# EAGLE board MAIN BOARD (EAGLE 5.11)
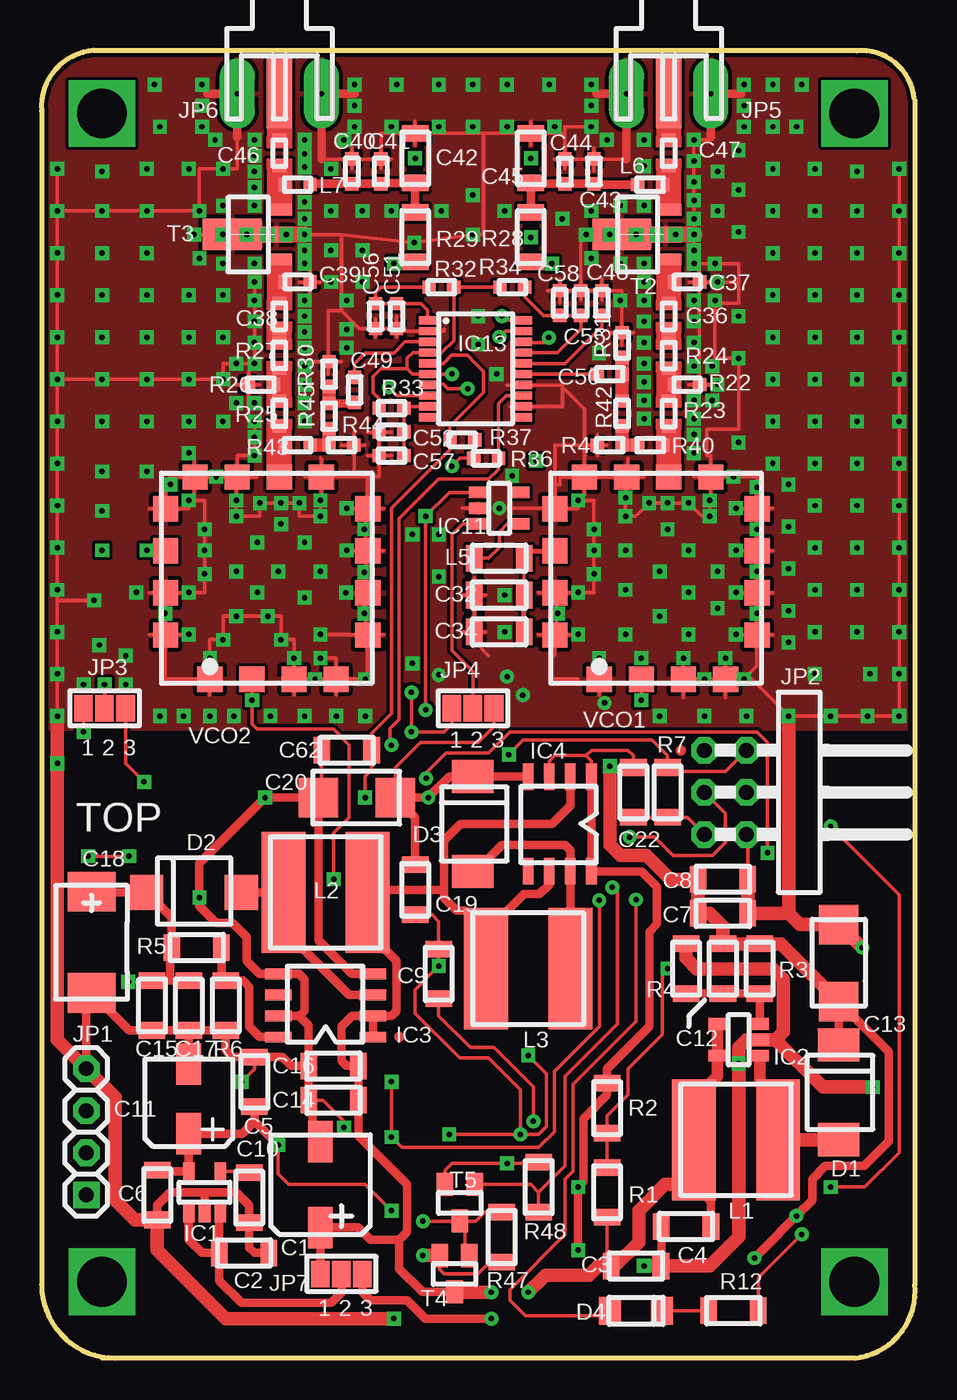
[diagram p2: board, top side]
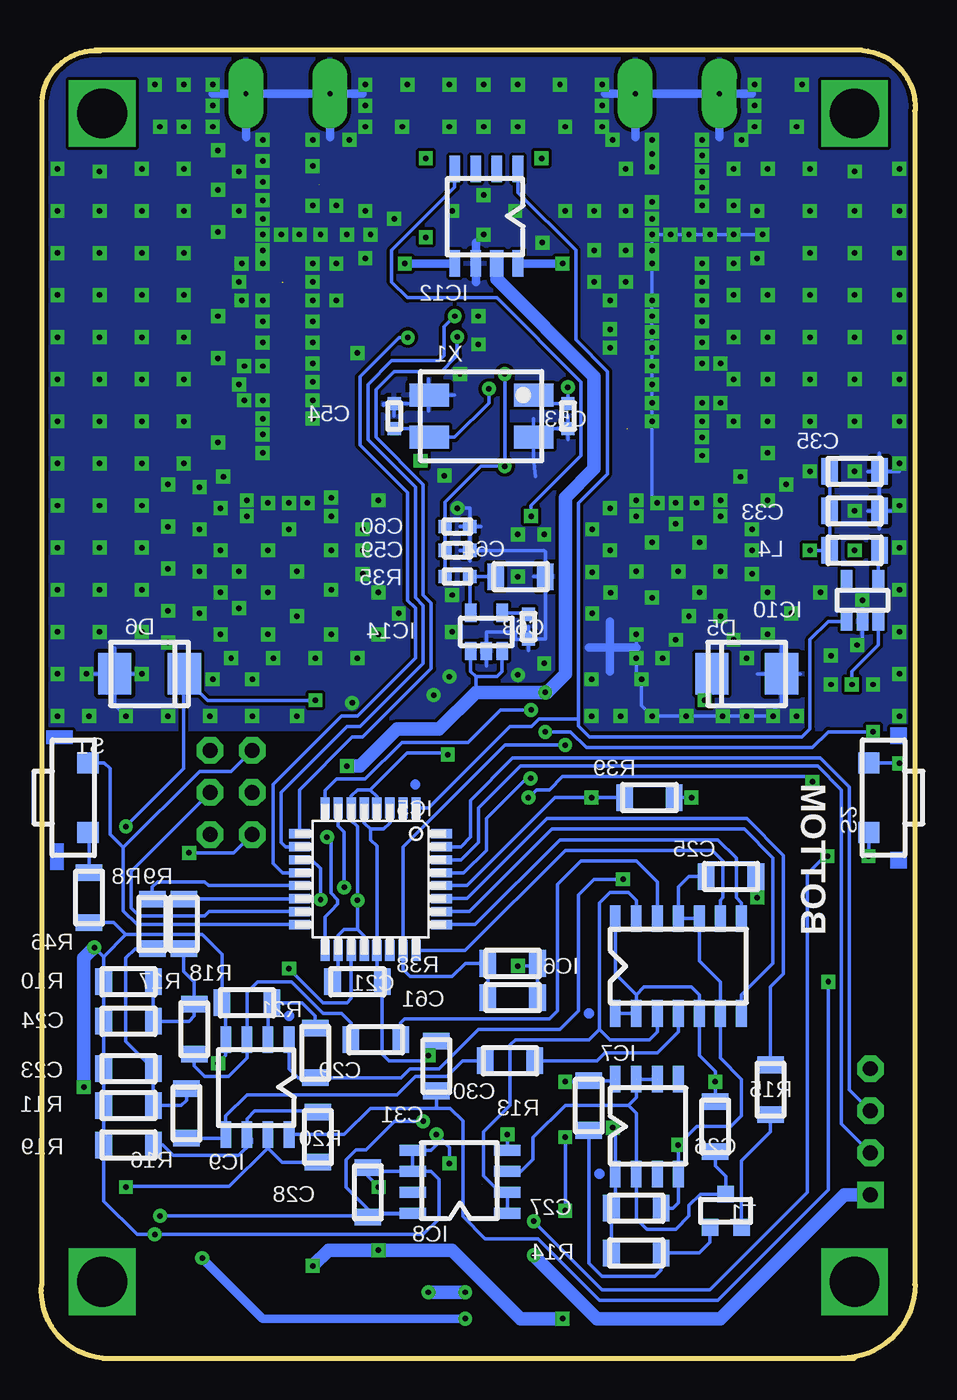
[diagram p3: board, bottom side, seen from below]

Size 52.73 x 78.9 mm. Coordinates in mm from the lower left corner, seen from the top.
Outline: 0.03,75.25 0.03,4.43
Outline: 3.18,78.9 49.54,78.9
Outline: 52.71,75.88 52.71,4.45 arc-90 49.06,0 4.45,0
Outline: 4.45,0 3.66,0
Outline: 3.18,78.9 arc90 0.01,75.25 arc-90 3.18,78.9
Outline: 52.67,76.01 arc90 49.18,78.86
Outline: 0.01,4.45 arc90 4.45,0
Copper layers (1*16): Top 0.035mm / dielectric 1.5mm / Bottom 0.035mm
Design rules "SparkFun *": minimum track width 7mil, minimum drill 13mil, track to track 8mil, track to pad 8mil, pad to pad 8mil, via to via 8mil, smd to smd 8mil, copper to edge 10mil, drill to drill 8mil, minimum pad ring 12mil, minimum via ring 10mil, stop-mask expansion 4mil, vias tented up to drill 25mil, thermal gap 10mil

## Footprints (pad centres in the part's own frame; a part is rotated, then mirrored left to right if it is on the bottom)
C1 = smd 1.5 x 2.5: 1 0,-2.594; 2 0,2.594
C2 = smd 1 x 1.6: 1 -1.5,0; 2 1.5,0
C3 = smd 1 x 1.6: 1 -1.5,0; 2 1.5,0
C4 = smd 1 x 1.6: 1 1.5,0; 2 -1.5,0
C5 = smd 1.6 x 1: 1 0,-1.5; 2 0,1.5
C6 = smd 1.6 x 1: 1 0,1.5; 2 0,-1.5
C7 = smd 1 x 1.6: 1 -1.5,0; 2 1.5,0
C8 = smd 1 x 1.6: 1 -1.5,0; 2 1.5,0
C9 = smd 1.6 x 1: 1 0,-1.5; 2 0,1.5
C10 = smd 1.6 x 1: 1 0,1.5; 2 0,-1.5
C11 = smd 1.5 x 2.5: 1 0,-1.865; 2 0,2.341
C12 = smd 1.6 x 1: 1 0,1.5; 2 0,-1.5
C13 = smd 2.388 x 2.388: 1 0,-2.311; 2 0,2.337
C14 = smd 1 x 1.6: 1 1.5,0; 2 -1.5,0
C15 = smd 1.6 x 1: 1 0,1.5; 2 0,-1.5
C16 = smd 1 x 1.6: 1 1.5,0; 2 -1.5,0
C17 = smd 1.6 x 1: 1 0,1.5; 2 0,-1.5
C18 = smd 2.896 x 2.388: 1 0,3.048; 2 0,-3.048
C19 = smd 1.6 x 1: 1 0,1.5; 2 0,-1.5
C20 = smd 2.388 x 2.388: 1 2.311,0; 2 -2.337,0
C21 = smd 1 x 1.6 bottom: 1 1.5,0; 2 -1.5,0
C22 = smd 1.6 x 1: 1 0,-1.5; 2 0,1.5
C23 = smd 1 x 1.6 bottom: 1 1.5,0; 2 -1.5,0
C24 = smd 1 x 1.6 bottom: 1 -1.5,0; 2 1.5,0
C25 = smd 1 x 1.6 bottom: 1 1.5,0; 2 -1.5,0
C26 = smd 1.6 x 1 bottom: 1 0,-1.5; 2 0,1.5
C27 = smd 1 x 1.6 bottom: 1 -1.5,0; 2 1.5,0
C28 = smd 1.6 x 1 bottom: 1 0,-1.5; 2 0,1.5
C29 = smd 1 x 1.6 bottom: 1 -1.5,0; 2 1.5,0
C30 = smd 1 x 1.6 bottom: 1 -1.5,0; 2 1.5,0
C31 = smd 1.6 x 1 bottom: 1 0,-1.5; 2 0,1.5
C32 = smd 1 x 1.6: 1 1.5,0; 2 -1.5,0
C33 = smd 1 x 1.6 bottom: 1 1.5,0; 2 -1.5,0
C34 = smd 1 x 1.6: 1 1.5,0; 2 -1.5,0
C35 = smd 1 x 1.6 bottom: 1 1.5,0; 2 -1.5,0
C36 = smd 0.8 x 0.8: 1 0,-0.75; 2 0,0.75
C37 = smd 0.8 x 0.8: 1 -0.75,0; 2 0.75,0
C38 = smd 0.8 x 0.8: 1 0,-0.75; 2 0,0.75
C39 = smd 0.8 x 0.8: 1 -0.75,0; 2 0.75,0
C40 = smd 0.8 x 0.8: 1 0,0.75; 2 0,-0.75
C41 = smd 0.8 x 0.8: 1 0,0.75; 2 0,-0.75
C42 = smd 1.6 x 1: 1 0,1.5; 2 0,-1.5
C43 = smd 0.8 x 0.8: 1 0,-0.75; 2 0,0.75
C44 = smd 0.8 x 0.8: 1 0,-0.75; 2 0,0.75
C45 = smd 1.6 x 1: 1 0,-1.5; 2 0,1.5
C46 = smd 0.8 x 0.8: 1 0,-0.75; 2 0,0.75
C47 = smd 0.8 x 0.8: 1 0,-0.75; 2 0,0.75
C48 = smd 0.8 x 0.8: 1 0,0.75; 2 0,-0.75
C49 = smd 0.8 x 0.8: 1 0,-0.75; 2 0,0.75
C50 = smd 0.8 x 0.8: 1 0.75,0; 2 -0.75,0
C51 = smd 0.8 x 0.8: 1 0,-0.75; 2 0,0.75
C52 = smd 0.8 x 0.8: 1 -0.75,0; 2 0.75,0
C53 = smd 0.8 x 0.8 bottom: 1 0,0.75; 2 0,-0.75
C54 = smd 0.8 x 0.8 bottom: 1 0,0.75; 2 0,-0.75
C55 = smd 0.8 x 0.8: 1 0,0.75; 2 0,-0.75
C56 = smd 0.8 x 0.8: 1 0,-0.75; 2 0,0.75
C57 = smd 0.8 x 0.8: 1 -0.75,0; 2 0.75,0
C58 = smd 0.8 x 0.8: 1 0,0.75; 2 0,-0.75
C59 = smd 0.8 x 0.8 bottom: 1 -0.75,0; 2 0.75,0
C60 = smd 0.8 x 0.8 bottom: 1 -0.75,0; 2 0.75,0
C61 = smd 1 x 1.6 bottom: 1 1.5,0; 2 -1.5,0
C62 = smd 1 x 1.6: 1 1.5,0; 2 -1.5,0
C63 = smd 0.8 x 0.8 bottom: 1 0,-0.75; 2 0,0.75
C64 = smd 1 x 1.6 bottom: 1 1.5,0; 2 -1.5,0
D1 = smd 2.5 x 2: 1 0,-2.856; 2 0,2.859
D2 = smd 2 x 2.1: 1 2.856,0; 2 -2.859,0
D3 = smd 2.5 x 2: 1 0,-2.856; 2 0,2.859
D4 = smd 1.315 x 1.68: 1 -1.568,0; 2 1.568,0
D5 = smd 2 x 2.5 bottom: 1 -2.1,0; 2 2.1,0
D6 = smd 2 x 2.5 bottom: 1 2.1,0; 2 -2.1,0
IC1 = smd 0.7 x 1.1: 1 -0.953,-1.27; 2 -0.001,-1.27; 3 0.951,-1.27; 4 0.952,1.27; 5 -0.954,1.27
IC2 = smd 1.1 x 0.7: 1 1.27,-0.953; 2 1.27,-0.001; 3 1.27,0.951; 4 -1.27,0.952; 5 -1.27,-0.954
IC3 = smd 1.6 x 0.65: 1 0,0; 2 0,1.27; 3 0,2.54; 4 0,3.81; 5 -5.715,3.81; 6 -5.715,2.54; 7 -5.715,1.27; 8 -5.715,0
IC4 = smd 0.65 x 1.6: 1 0,0; 2 -1.27,0; 3 -2.54,0; 4 -3.81,0; 5 -3.81,-5.715; 6 -2.54,-5.715; 7 -1.27,-5.715; 8 0,-5.715
IC5 = smd 0.559 x 1.27 bottom: 1 -2.743,4.293; 2 -1.956,4.293; 3 -1.168,4.293; 4 -0.381,4.293; 5 0.381,4.293; 6 1.168,4.293; 7 1.956,4.293; 8 2.743,4.293; 17 2.743,-4.293; 18 1.956,-4.293; 19 1.168,-4.293; 20 0.381,-4.293; 21 -0.381,-4.293; 22 -1.168,-4.293; 23 -1.956,-4.293; 24 -2.743,-4.293 | smd 1.27 x 0.559 bottom: 9 4.293,2.743; 10 4.293,1.956; 11 4.293,1.168; 12 4.293,0.381; 13 4.293,-0.381; 14 4.293,-1.168; 15 4.293,-1.956; 16 4.293,-2.743; 25 -4.293,-2.743; 26 -4.293,-1.956; 27 -4.293,-1.168; 28 -4.293,-0.381; 29 -4.293,0.381; 30 -4.293,1.168; 31 -4.293,1.956; 32 -4.293,2.743
IC6 = smd 0.65 x 1.6 bottom: 1 0,0; 2 -1.27,0; 3 -2.54,0; 4 -3.81,0; 5 -5.08,0; 6 -6.35,0; 7 -7.62,0; 8 -7.62,5.715; 9 -6.35,5.715; 10 -5.08,5.715; 11 -3.81,5.715; 12 -2.54,5.715; 13 -1.27,5.715; 14 0,5.715
IC7 = smd 0.65 x 1.6 bottom: 1 0,0; 2 -1.27,0; 3 -2.54,0; 4 -3.81,0; 5 -3.81,5.715; 6 -2.54,5.715; 7 -1.27,5.715; 8 0,5.715
IC8 = smd 1.6 x 0.65 bottom: 1 0,0; 2 0,1.27; 3 0,2.54; 4 0,3.81; 5 5.715,3.81; 6 5.715,2.54; 7 5.715,1.27; 8 5.715,0
IC9 = smd 0.65 x 1.6 bottom: 1 0,0; 2 1.27,0; 3 2.54,0; 4 3.81,0; 5 3.81,-5.715; 6 2.54,-5.715; 7 1.27,-5.715; 8 0,-5.715
IC10 = smd 0.7 x 1.1 bottom: 1 0.953,-1.27; 2 0.001,-1.27; 3 -0.951,-1.27; 4 -0.952,1.27; 5 0.954,1.27
IC11 = smd 1.1 x 0.7: 1 -1.27,0.953; 2 -1.27,0.001; 3 -1.27,-0.951; 4 1.27,-0.952; 5 1.27,0.954
IC12 = smd 0.65 x 1.6 bottom: 1 0,0; 2 1.27,0; 3 2.54,0; 4 3.81,0; 5 3.81,-5.715; 6 2.54,-5.715; 8 0,-5.715 | smd 0.8 x 1.6 bottom: 7 1.27,-5.715
IC13 = smd 1 x 0.5: 1 -2.9,2.925; 2 -2.9,2.275; 3 -2.9,1.625; 4 -2.9,0.975; 5 -2.9,0.325; 6 -2.9,-0.325; 7 -2.9,-0.975; 8 -2.9,-1.625; 9 -2.9,-2.275; 10 -2.9,-2.925; 11 2.9,-2.925; 12 2.9,-2.275; 13 2.9,-1.625; 14 2.9,-0.975; 15 2.9,-0.325; 16 2.9,0.325; 17 2.9,0.975; 18 2.9,1.625; 19 2.9,2.275; 20 2.9,2.925
IC14 = smd 0.7 x 1.1 bottom: 1 0.95,-1.15; 2 0.001,-1.15; 3 -0.95,-1.15; 4 -0.95,1.15; 5 0.95,1.15
JP1 = drill 0.9 pad 1.6 square: 1 0,0 | drill 0.9 pad 1.6 octagon: 2 0,2.54; 3 0,5.08; 4 0,7.62
JP2 = drill 0.9 pad 1.6 octagon: 1 0,0; 2 2.54,0; 3 0,-2.54; 4 2.54,-2.54; 5 0,-5.08; 6 2.54,-5.08
JP3 = smd 1.12 x 1.6: 1 -1.27,0; 2 0,0; 3 1.27,0
JP4 = smd 1.12 x 1.6: 1 -1.27,0; 2 0,0; 3 1.27,0
JP5 = drill 0.3 pad 2.096 long: 1 -2.54,-2.286; 3 2.54,-2.286 | smd 1.524 x 4.191: 2 0,-2.286
JP6 = drill 0.3 pad 2.096 long: 1 -2.54,-2.286; 3 2.54,-2.286 | smd 1.524 x 4.191: 2 0,-2.286
JP7 = smd 1.12 x 1.6: 1 -1.27,0; 2 0,0; 3 1.27,0
L1 = smd 2.65 x 7.3: 1 0,0; 2 5.08,0
L2 = smd 2.65 x 7.3: 1 0,0; 2 -5.08,0
L3 = smd 2.65 x 7.3: 1 0,0; 2 5.08,0
L4 = smd 1 x 1.6 bottom: 1 1.5,0; 2 -1.5,0
L5 = smd 1 x 1.6: 1 1.5,0; 2 -1.5,0
L6 = smd 0.8 x 0.8: 1 0.75,0; 2 -0.75,0
L7 = smd 0.8 x 0.8: 1 -0.75,0; 2 0.75,0
R1 = smd 1.6 x 1: 1 0,-1.5; 2 0,1.5
R2 = smd 1.6 x 1: 1 0,-1.5; 2 0,1.5
R3 = smd 1.6 x 1: 1 0,1.5; 2 0,-1.5
R4 = smd 1.6 x 1: 1 0,-1.5; 2 0,1.5
R5 = smd 1 x 1.6: 1 -1.5,0; 2 1.5,0
R6 = smd 1.6 x 1: 1 0,1.5; 2 0,-1.5
R7 = smd 1.6 x 1: 1 0,1.5; 2 0,-1.5
R8 = smd 1.6 x 1 bottom: 1 0,1.5; 2 0,-1.5
R9 = smd 1.6 x 1 bottom: 1 0,1.5; 2 0,-1.5
R10 = smd 1 x 1.6 bottom: 1 -1.5,0; 2 1.5,0
R11 = smd 1 x 1.6 bottom: 1 1.5,0; 2 -1.5,0
R12 = smd 1 x 1.6: 1 1.5,0; 2 -1.5,0
R13 = smd 1.6 x 1 bottom: 1 0,1.5; 2 0,-1.5
R14 = smd 1 x 1.6 bottom: 1 -1.5,0; 2 1.5,0
R15 = smd 1.6 x 1 bottom: 1 0,1.5; 2 0,-1.5
R16 = smd 1.6 x 1 bottom: 1 0,-1.5; 2 0,1.5
R17 = smd 1.6 x 1 bottom: 1 0,-1.5; 2 0,1.5
R18 = smd 1 x 1.6 bottom: 1 -1.5,0; 2 1.5,0
R19 = smd 1 x 1.6 bottom: 1 -1.5,0; 2 1.5,0
R20 = smd 1.6 x 1 bottom: 1 0,-1.5; 2 0,1.5
R21 = smd 1.6 x 1 bottom: 1 0,-1.5; 2 0,1.5
R22 = smd 0.8 x 0.8: 1 -0.75,0; 2 0.75,0
R23 = smd 0.8 x 0.8: 1 0,-0.75; 2 0,0.75
R24 = smd 0.8 x 0.8: 1 0,-0.75; 2 0,0.75
R25 = smd 0.8 x 0.8: 1 0,0.75; 2 0,-0.75
R26 = smd 0.8 x 0.8: 1 0.75,0; 2 -0.75,0
R27 = smd 0.8 x 0.8: 1 0,0.75; 2 0,-0.75
R28 = smd 1.6 x 1: 1 0,1.5; 2 0,-1.5
R29 = smd 1.6 x 1: 1 0,1.5; 2 0,-1.5
R30 = smd 0.8 x 0.8: 1 0,-0.75; 2 0,0.75
R31 = smd 0.8 x 0.8: 1 0,-0.75; 2 0,0.75
R32 = smd 0.8 x 0.8: 1 0.75,0; 2 -0.75,0
R33 = smd 0.8 x 0.8: 1 -0.75,0; 2 0.75,0
R34 = smd 0.8 x 0.8: 1 -0.75,0; 2 0.75,0
R35 = smd 0.8 x 0.8 bottom: 1 0.75,0; 2 -0.75,0
R36 = smd 0.8 x 0.8: 1 -0.75,0; 2 0.75,0
R37 = smd 0.8 x 0.8: 1 0.75,0; 2 -0.75,0
R38 = smd 1 x 1.6 bottom: 1 1.5,0; 2 -1.5,0
R39 = smd 1 x 1.6 bottom: 1 1.5,0; 2 -1.5,0
R40 = smd 0.8 x 0.8: 1 -0.75,0; 2 0.75,0
R41 = smd 0.8 x 0.8: 1 0.75,0; 2 -0.75,0
R42 = smd 0.8 x 0.8: 1 0,0.75; 2 0,-0.75
R43 = smd 0.8 x 0.8: 1 0.75,0; 2 -0.75,0
R44 = smd 0.8 x 0.8: 1 -0.75,0; 2 0.75,0
R45 = smd 0.8 x 0.8: 1 0,0.75; 2 0,-0.75
R46 = smd 1.6 x 1 bottom: 1 0,1.5; 2 0,-1.5
R47 = smd 1.6 x 1: 1 0,1.5; 2 0,-1.5
R48 = smd 1.6 x 1: 1 0,-1.5; 2 0,1.5
S1 = smd 1.27 x 1.27 bottom: 1 -0.885,2.1; 2 -0.885,-2.1
S2 = smd 1.27 x 1.27 bottom: 1 0.885,-2.1; 2 0.885,2.1
T1 = smd 1 x 1 bottom: 1 0.95,-1; 2 -0.95,-1; 3 0,1
T2 = smd 1.524 x 0.711: 1 2.2,-1.5; 3 2.2,1.5 | smd 1.85 x 0.965: 2 2.037,0 | smd 3.556 x 1.905: 4 -0.635,0
T3 = smd 1.524 x 0.711: 1 2.2,-1.5; 3 2.2,1.5 | smd 1.85 x 0.965: 2 2.037,0 | smd 3.556 x 1.905: 4 -0.635,0
T4 = smd 1 x 1.4: 1 0.9,1.111; 2 -0.9,1.111; 3 0,-1.089
T5 = smd 1 x 1.4: 1 0.9,1.111; 2 -0.9,1.111; 3 0,-1.089
VCO1 = smd 1.524 x 1.524: 1 0,0; 2 2.54,0; 3 5.08,0; 4 7.62,0; 5 9.525,2.667; 6 9.525,5.207; 7 9.525,7.747; 8 9.525,10.287; 9 6.731,12.192; 10 4.191,12.192; 11 1.651,12.192; 12 -0.889,12.192; 13 -2.667,10.287; 14 -2.667,7.747; 15 -2.667,5.207; 16 -2.667,2.667
VCO2 = smd 1.524 x 1.524: 1 0,0; 2 2.54,0; 3 5.08,0; 4 7.62,0; 5 9.525,2.667; 6 9.525,5.207; 7 9.525,7.747; 8 9.525,10.287; 9 6.731,12.192; 10 4.191,12.192; 11 1.651,12.192; 12 -0.889,12.192; 13 -2.667,10.287; 14 -2.667,7.747; 15 -2.667,5.207; 16 -2.667,2.667
X1 = smd 2.4 x 1.4 bottom: 1 0,0; 2 0,-2.54; 3 6.3,-2.54; 4 6.3,0

## Placement (x,y rotation side)
C1  100u/6.3V  [C1]  16.83,10.48 0 top
C2  100n  [C2]  12.23,6.35 0 top
C3  100n  [C3]  35.88,5.56 0 top
C4  1u  [C4]  38.9,7.94 0 top
C5  1u  [C5]  12.86,16.67 0 top
C6  100n  [C6]  6.99,9.84 0 top
C7  100n  [C7]  41.12,26.83 0 top
C8  1u  [C8]  41.12,28.89 0 top
C9  100n  [C9]  23.98,23.18 0 top
C10  10n  [C10]  12.55,9.68 0 top
C11  100u/4V  [C11]  8.89,15.4 0 top
C12  470p  [C12]  41.12,23.5 0 top
C13  100u/10V  [C13]  48.11,23.81 0 top
C14  1u  [C14]  17.63,15.56 0 top
C15  1u  [C15]  6.67,21.27 0 top
C16  100n  [C16]  17.63,17.62 0 top
C17  100n  [C17]  8.89,21.27 0 top
C18  22u/35V  [C18]  3.02,25.08 0 top
C19  100n  [C19]  22.55,28.26 0 top
C20  68u/16V  [C20]  19.05,33.81 0 top
C21  100n  [C21]  33.66,22.7 0 top
C22  100n  [C22]  35.72,34.13 0 top
C23  4.7u  [C23]  47.47,17.46 0 top
C24  4.7u  [C24]  47.47,20.32 0 top
C25  100n  [C25]  11.12,29.05 0 top
C26  100n  [C26]  12.07,13.97 0 top
C27  100n  [C27]  16.83,9.05 0 top
C28  100n  [C28]  33.02,10 0 top
C29  4.7u  [C29]  32.55,19.21 0 top
C30  4.7u  [C30]  24.45,17.94 0 top
C31  100n  [C31]  28.9,17.62 0 top
C32  100n  [C32]  27.63,46.04 0 top
C33  100n  [C33]  3.66,51.12 0 top
C34  1u  [C34]  27.63,43.81 0 top
C35  1u  [C35]  3.66,53.5 0 top
C36  68p  [C36]  37.85,62.87 0 top
C37  *  [C37]  38.96,64.93 0 top
C38  100p  [C38]  14.36,62.87 0 top
C39  *  [C39]  15.46,64.93 0 top
C40  68p  [C40]  18.74,71.6 0 top
C41  1000p  [C41]  20.48,71.6 0 top
C42  1u  [C42]  22.55,72.39 0 top
C43  22p  [C43]  33.34,71.6 0 top
C44  1000p  [C44]  31.6,71.6 0 top
C45  1u  [C45]  29.53,72.39 0 top
C46  100p  [C46]  14.36,72.71 0 top
C47  68p  [C47]  37.85,72.71 0 top
C48  100p  [C48]  33.82,63.66 0 top
C49  100p  [C49]  18.9,58.42 0 top
C50  100p  [C50]  34.29,59.37 0 top
C51  100p  [C51]  21.44,62.87 0 top
C52  100p  [C52]  21.12,55.88 0 top
C53  22p  [C53]  20.96,56.83 0 top
C54  22p  [C54]  31.44,56.83 0 top
C55  100p  [C55]  32.55,63.66 0 top
C56  10n  [C56]  20.17,62.87 0 top
C57  10n  [C57]  21.12,54.45 0 top
C58  10n  [C58]  31.28,63.66 0 top
C59  100n  [C59]  27.63,48.74 0 top
C60  1u  [C60]  27.63,50.16 0 top
C61  100n  [C61]  24.29,21.75 0 top
C62  100n  [C62]  18.42,36.67 0 top
C63  10n  [C63]  23.34,44.13 0 top
C64  1u  [C64]  23.82,47.15 0 top
D1  SS14  [D1]  48.11,16.03 0 top
D2  SS14  [D2]  9.21,28.1 0 top
D3  SS14  [D3]  26.04,32.23 0 top
D4  GREEN  [D4]  35.88,2.86 0 top
D5  SMAZ22-13-F  [D5]  10.16,41.27 0 top
D6  SMAZ22-13-F  [D6]  46.2,41.27 0 top
IC1  TPS79333  [IC1]  9.85,10 0 top
IC2  LM2731Y  [IC2]  42.07,19.21 0 top
IC3  LT1173CS8  [IC3]  20.01,19.37 0 top
IC4  LT1301CS8  [IC4]  33.18,35.08 0 top
IC5  ATMEGA168-10V  [IC5]  32.87,28.89 0 top
IC6  AD8402ARZ10  [IC6]  18.1,20.8 0 top
IC7  NE555D  [IC7]  18.1,11.11 0 top
IC8  LM358D  [IC8]  24.61,8.73 0 top
IC9  LM358D  [IC9]  37.79,19.21 0 top
IC10  MIC2514  [IC10]  3.18,45.72 0 top
IC11  MIC2514  [IC11]  27.63,51.28 0 top
IC12  MIC2506YM  [IC12]  23.98,71.75 0 top
IC13  LMX2433  [IC13]  26.2,59.69 0 top
IC14  LP2985AIM5-2.5CT  [IC14]  25.88,43.81 0 top
JP1  USB/Batt Board  [JP1]  2.7,9.84 0 top
JP2  ISP  [JP2]  40.01,36.67 0 top
JP3  VCO voltage select  [JP3]  3.81,39.21 0 top
JP4  VCO Voltage select  [JP4]  26.04,39.21 0 top
JP5  SMA J629-ND  [JP5]  37.85,78.58 0 top
JP6  SMA J629-ND  [JP6]  14.36,78.58 0 top
JP7  3.3V supply select  [JP7]  18.1,5.08 0 top
L1  7.3uH  [L1]  39.37,13.18 0 top
L2  33uH  [L2]  19.69,28.1 0 top
L3  33uH  [L3]  26.83,23.5 0 top
L4  FERRIT  [L4]  3.66,48.74 0 top
L5  FERRIT  [L5]  27.63,48.26 0 top
L6  22nH  [L6]  36.73,70.8 0 top
L7  33nH  [L7]  15.46,70.8 0 top
R1  510K  [R1]  34.14,10 0 top
R2  330K  [R2]  34.14,15.08 0 top
R3  47K  [R3]  43.34,23.5 0 top
R4  13K  [R4]  38.9,23.5 0 top
R5  820K  [R5]  9.37,24.77 0 top
R6  50K  [R6]  11.12,21.27 0 top
R7  10K  [R7]  37.79,34.13 0 top
R8  1K  [R8]  46.04,26.19 0 top
R9  1K  [R9]  44.14,26.19 0 top
R10  *  [R10]  47.47,22.7 0 top
R11  *  [R11]  47.47,15.24 0 top
R12  750  [R12]  41.76,2.86 0 top
R13  10K  [R13]  19.69,15.24 0 top
R14  20K  [R14]  16.83,6.35 0 top
R15  68  [R15]  8.74,16.19 0 top
R16  10K  [R16]  43.98,14.76 0 top
R17  10K  [R17]  43.5,19.84 0 top
R18  10K  [R18]  40.33,21.43 0 top
R19  10K  [R19]  47.47,12.86 0 top
R20  30K(47K)  [R20]  36.04,13.34 0 top
R21  30K(47K)  [R21]  36.2,18.41 0 top
R22  *  [R22]  38.96,58.74 0 top
R23  0  [R23]  37.85,56.99 0 top
R24  0  [R24]  37.85,60.48 0 top
R25  0  [R25]  14.36,56.99 0 top
R26  *  [R26]  13.24,58.74 0 top
R27  0  [R27]  14.36,60.48 0 top
R28  1  [R28]  29.53,67.63 0 top
R29  1  [R29]  22.55,67.63 0 top
R30  50  [R30]  17.35,59.37 0 top
R31  50  [R31]  35.04,61.12 0 top
R32  18  [R32]  24.13,64.61 0 top
R33  18  [R33]  21.12,57.31 0 top
R34  18  [R34]  28.42,64.61 0 top
R35  18  [R35]  27.63,47.15 0 top
R36  10K  [R36]  26.83,54.29 0 top
R37  10K  [R37]  25.4,55.4 0 top
R38  10K  [R38]  24.29,23.81 0 top
R39  10K  [R39]  16.04,33.81 0 top
R40  10  [R40]  36.73,55.09 0 top
R41  120  [R41]  34.29,55.09 0 top
R42  10  [R42]  35.04,56.99 0 top
R43  22  [R43]  15.46,55.09 0 top
R44  47  [R44]  18.1,55.09 0 top
R45  22  [R45]  17.35,56.83 0 top
R46  100  [R46]  49.85,27.78 0 top
R47  100K  [R47]  27.79,7.3 0 top
R48  100K  [R48]  30.01,10.32 0 top
S1  Cycle Program  [S1]  50.8,33.81 0 top
S2  Power ON  [S2]  1.91,33.81 0 top
T1  MMBT3906  [T1]  11.43,8.89 0 top
T2  GALI-84 / SGA-7489Z  [T2]  35.65,67.79 0 top
T3  GALI-84 / SGA-7489Z  [T3]  12.16,67.79 0 top
T4  FDN302P  [T4]  24.93,5.08 0 top
T5  FDV303N  [T5]  25.25,9.37 0 top
VCO1  ROS-2700-1819  [VCO1]  33.66,40.96 0 top
VCO2  ROS-1300  [VCO2]  10.16,40.96 0 top
X1  10MHz  [X1]  23.02,58.1 0 top

## Tracks (layer width: path | path; a pad name or v marks a point on that pad's centre or on a via)
1  (via drill 0.33 pad 0.25)
  Top 0.2: T4.2 24.03,5.34 24.29,5.08 26.36,5.08 26.83,5.56 27.54,5.56 R47.2
  Top 0.8: v23.02,6.19 T4.2
  Bottom 0.8: JP1.1 4.29,9.84 11.75,2.38 19.21,2.38 v23.02,6.19
2
  Top 0.5: L1.2 44.45,15.56 | D1.1
  Top 0.7: IC2.1 43.34,16.67 44.45,15.56
  Top 0.8: L1.2 D1.1
3
  Bottom 0.2: JP1.3 3.97,16.19 3.97,34.45 5.72,36.2 24.29,36.2 26.83,33.66 26.83,31.43 27.42,30.85 IC5.31
3.3V  (via drill 0.33)  (1 unrouted)
  Top 0.2: v21.12,16.67 v21.12,13.34 21.75,12.7 30.01,12.7 30.96,13.65 30.96,17.3 33.66,20 v33.66,27.61 | v21.12,8.89 19.53,10.48 14.93,10.48 IC7.4 v14.29,12.86 | JP2.2 41.28,35.4 38.02,35.4 R7.1 37.79,36.35 36.83,37.31 29.05,37.31 v28.21,36.41
  Top 0.5: C6.1 7.06,11.27 IC1.5 C11.1 12.11,13.53 12.86,14.29 | 12.86,14.29 C5.1 | 12.86,14.29 v14.29,12.86
  Bottom 0.2: IC5.4 32.49,33.88 32.9,34.29 | 32.9,34.29 33.66,34.29 34.03,33.91 IC5.6 34.03,32.44 33.66,32.07 v33.66,27.61 33.66,25.88 | IC5.20 33.25,25.46 33.66,25.88 | 33.66,25.88 34.45,25.88 34.82,25.51 IC5.18 34.82,23.04 C21.1 | IC7.8 18.19,16.74 R13.1 19.76,16.67 v21.12,16.67 | v21.12,8.89 v21.12,13.34 | C25.1 13.66,29.05 14.29,28.42 IC6.11 IC6.10 13.02,23.97 11.75,22.7 IC6.6 11.75,18.1 10.48,16.83 10.48,14.61 11.12,13.97 13.18,13.97 v14.29,12.86 IC7.4 14.29,9.37 14.61,9.05 C27.1 | 32.9,34.29 30.68,36.51 28.31,36.51 v28.21,36.41
  Bottom 0.5: IC5.20
5V  (via drill 0.33, 0.33 pad 0.25)
  Top 0.2: v29.69,14.29 29.69,16.35 27.31,18.73 25.88,18.73 23.98,20.64 C9.1 | JP4.1 24.77,38.26 24.29,37.78 v22.33,37.78 v22.33,40.16 | v2.54,37.78 JP3.1
  Top 0.5: v27.15,2.38 23.18,2.38 22.07,3.49 19.85,3.49 19.37,3.97 JP7.3 | D1.2 C13.1 51.12,18.48 51.12,13.07 49.64,11.59 47.31,11.59 46.52,10.79 46.52,9.53 v45.57,8.57 43.52,6.53 v43.03,6.03
  Top 0.8: v34.29,35.72 34.29,30.96 34.93,30.32 36.52,30.32 37.95,28.89 C8.1 C7.1 40.33,26.83 41.12,26.04 C12.1 R3.1 44.61,25 C13.1
  Bottom 0.2: IC14.3 24.93,41.43 25.25,41.12 26.52,41.12 | 26.52,41.12 26.83,41.43 IC14.1 | 26.52,40.16 26.52,41.12 | v22.33,37.78 20.8,37.78 19.85,36.83 6.2,36.83 5.24,37.78 v2.54,37.78 | 45.49,8.5 v45.57,8.57 33.73,8.57 33.6,8.7 30.36,8.7 IC8.8 32.78,8.73 33.02,8.97 | v29.69,14.29 31.42,14.29 33.15,12.55 33.75,12.55 34.35,11.95 34.35,10.3 33.02,8.97 | 33.02,8.97 C28.1
  Bottom 0.5: v27.15,2.38 39.38,2.38 v43.03,6.03
  Bottom 0.8: v34.29,35.72 33.5,35.72 31.28,37.94 28.74,37.94 26.52,40.16 v22.33,40.16 22.23,40.16 21.12,41.27 21.12,51.91 19.37,53.66 19.37,59.21 25.25,65.09 IC12.7
12V  (via drill 0.33)
  Top 0.2: C20.1 21.37,35.65 22.86,37.15 26.36,37.15 27.31,38.1 JP4.3 | v6.2,34.77 5.08,35.88 JP3.3
  Top 0.5: IC4.4 D3.2 24.61,35.09 v23.34,33.81 C20.1 22.55,32.63 C19.1
  Bottom 0.2: v23.34,33.81 22.86,34.29 22.07,34.29 21.28,35.08 6.51,35.08 v6.2,34.77
24V  (via drill 0.33)
  Top 0.2: v5.24,22.7 6.6,22.7 C15.1
  Top 0.5: C15.1 7.78,22.77 | C18.1 3.05,28.1 D2.2 7.87,26.58 R5.1 7.78,24.68 7.78,22.77 | 7.78,22.77 C17.1
  Bottom 0.2: 28.9,15.08 C31.1 | 28.9,15.08 32.87,15.08 34.45,13.49 IC9.8 | v5.24,22.7 5.24,10.16 11.91,3.49 19.05,3.49 22.76,7.2 25.95,7.2 27.3,8.55 27.3,14.3 28.08,15.08 28.9,15.08
+
  Bottom 0.2: C30.2 27.31,17.94 28.26,16.99 30.17,16.99 31.28,15.88 40.33,15.88 41.6,14.61 IC9.5 41.83,13.26 R16.1
BYPASS
  Top 0.2: IC1.4 12.46,11.27 C10.1
CLK
  Bottom 0.2: IC6.9 11.75,27.62 11.59,27.78 11.59,30 12.23,30.64 21.12,30.64 27.16,24.6 IC5.24
CPOUTRF  (via drill 0.33)
  Top 0.2: IC13.13 28.07,58.06 27.58,57.58 R36.2 27.58,53.61 26.99,53.02 23.98,53.02 21.59,50.64 21.59,38.54 21.05,38 21.05,37.05 v21.12,36.99
  Bottom 0.2: C61.1 R38.1 27.15,23.81 27.94,23.02 30.48,23.02 30.91,23.44 IC5.23 30.91,25 30.91,30.85 24.77,36.99 v21.12,36.99
CS  (1 unrouted)
  Bottom 0.2: IC6.7 10.48,21.91 8.58,23.81 8.58,30.16 10.32,31.91 21.91,31.91 26.88,26.94 IC5.26
CTLA
  Bottom 0.2: IC5.1 29.37,33.19 24.45,38.1 23.15,38.1 22.7,38.55 20.32,38.55 | IC10.1 5.24,44.45 6.35,43.34 6.35,37.94 6.83,37.47 19.67,37.47 20.32,38.12 20.32,38.55 | IC12.1 23.98,70.33 20.48,66.83 20.48,61.44 18.58,59.53 18.58,53.34 20.32,51.59 20.32,38.55
  Bottom 0.406: IC10.1
CTLB  (via drill 0.33)
  Top 0.2: v23.18,39.11 v23.18,50.8 24.61,52.23 IC11.1
  Bottom 0.2: IC5.8 35.61,34.25 34.93,34.92 33.18,34.92 30.96,37.15 26.99,37.15 25.03,39.11 v23.18,39.11 | IC12.4 27.79,70.64 31.6,66.83 31.6,64.93 30.64,63.98 25.25,63.98 20.17,58.9 20.17,54.45 23.18,51.44 v23.18,50.8
DATA  (via drill 0.33)
  Top 0.2: v27.79,62.87 28.04,62.62 IC13.20
  Bottom 0.2: IC5.10 38,30.85 38.26,31.11 38.26,34.13 34.29,38.1 33.5,38.1 29.69,41.91 29.69,45.4 30.17,45.88 30.17,52.55 33.02,55.4 33.02,58.74 31.6,60.17 28.74,60.17 28.42,60.48 28.42,62.23 v27.79,62.87
  Bottom 0.5: IC5.10
FB
  Top 0.5: R4.1 C12.2 R3.2 IC2.3
FINRF#
  Top 0.2: IC13.16 31.6,60.02 33.82,62.23 C48.2
G  (via drill 0.33, 0.33 pad 0.25)
  Top 0.2: 25.9,6.12 T4.1 25.56,6.46 25.56,7.96 T5.3 25.22,8.26 | v5.29,30.28 v2.81,30.28 | v23.02,8.26 25.05,8.26 25.22,8.26 | 25.22,8.26 26.2,8.26 26.75,8.8 R47.1
  Top 0.406: T5.3 25.05,8.28 25.05,8.26
  Bottom 0.2: S2.1 2.86,31.65 2.81,31.6 v2.81,30.28 | v23.02,8.26 18.9,4.13 12.39,4.13 6.51,10 6.51,29.21 5.44,30.28 v5.29,30.28
GND  (via drill 0.33, 0.33 pad 0.25)  (1 unrouted)
  Top 0.2: C19.2 23.57,26.76 23.98,26.35 C9.2 v23.98,23.65 22.55,22.23 22.55,20.8 25.25,18.1 26.99,18.1 28.9,16.19 v28.9,13.49 | IC4.1 33.18,36.04 32.87,36.35 | 32.87,36.35 30.96,36.35 30.64,36.04 IC4.3 | C62.2 16.92,34.02 C20.2 | v12.07,16.67 12.86,17.46 C5.2 | v28.9,13.49 v24.61,13.49 | 10.48,53.15 10.48,53.18 | v8.89,51.75 9.85,51.75 v9.85,50.01 v9.85,48.74 v9.85,47.31 9.85,46.2 v8.89,46.2 7.5,46.2 | 7.5,46.2 VCO2.15 7.47,46.2 | 7.47,43.62 VCO2.16 7.47,43.66 | 7.47,43.66 v7.47,44.93 7.47,46.2 | 7.47,43.66 v8.89,43.66 | 7.47,43.62 7.47,40.96 VCO2.1 | VCO2.1 v10.16,42.23 10.16,43.34 v10.96,43.34 10.96,44.77 v11.75,44.77 v13.66,44.77 14.45,44.77 v14.45,43.34 15.24,43.34 v15.24,42.23 VCO2.3 | VCO2.3 v16.51,40.96 VCO2.4 | 19.69,53.18 VCO2.8 | 19.69,48.74 v18.42,48.74 | VCO2.8 18.42,51.24 | 16.9,53.18 16.9,51.75 v16.83,51.75 v16.83,50.8 15.56,50.8 v15.56,51.59 v14.45,51.59 v13.18,51.59 13.18,50.8 v11.75,50.8 v11.75,51.75 11.75,53.02 | 19.69,43.66 v16.83,43.66 | VCO2.4 17.78,42.23 v16.83,42.23 | VCO2.5 20.01,43.66 | 33.98,53.15 VCO1.12 | VCO1.12 31.28,53.15 31.28,52.7 30.99,52.7 | 33.98,53.15 33.98,53.18 | 30.99,46.2 v32.39,46.2 33.34,46.2 v33.34,47.31 v33.34,48.74 v33.34,50.01 33.34,51.75 v32.39,51.75 32.39,51.24 VCO1.13 | 30.99,46.2 VCO1.15 30.96,46.2 | 30.96,43.62 VCO1.16 30.96,43.66 | 30.96,43.66 v31.16,44.93 30.96,46.2 | 30.96,43.66 v32.39,43.66 | 30.96,43.62 30.96,42.39 | 30.96,40.96 32.39,40.96 | v33.66,42.23 VCO1.1 33.66,40.01 | VCO1.3 v38.74,42.23 | VCO1.4 v40.01,40.96 VCO1.3 | VCO1.6 41.91,46.16 | 43.18,48.74 v41.91,48.74 | VCO1.8 41.91,51.24 v41.91,51.28 | 40.39,53.18 40.39,51.75 v40.33,51.75 v40.33,50.8 39.85,50.8 v39.06,51.59 v37.79,51.59 v36.68,51.59 35.88,50.8 v35.25,50.8 v35.25,51.91 35.31,51.91 VCO1.11
  Top 0.2: 43.18,43.66 v41.91,43.66 | VCO1.4 v41.28,42.23 | VCO1.5 43.5,43.66 | 7.47,43.66 7.47,43.62 | 19.69,43.66 v19.49,44.93 v19.49,47.42 19.69,48.74 | 19.69,48.74 v19.49,50.01 VCO2.8 | 30.96,43.66 30.96,43.62 | VCO1.6 v43.18,44.93 43.18,43.66 | VCO1.8 v43.18,50.01 43.18,48.74 | 40.39,53.18 v41.76,53.18 43.18,53.18 v43.18,52.55 43.18,51.28 | IC11.2 | 30.96,51.28 30.48,51.75 | 26.99,42.39 26.13,43.25 C34.2 | C34.2 C32.2 | v0.96,38.73 v0.96,41.27 v0.96,43.81 0.96,45.72 | VCO2.11 11.91,53.24 | C32.2 26.83,46.04 | C32.2 25.4,46.04 | C32.2 26.13,47.08 | C34.2 26.83,43.81 | C34.2 25.4,43.81 | v8.89,51.75 8.89,51.24 VCO2.13 | VCO2.13 7.5,52.7 v7.78,52.7 7.78,53.15 9.21,53.15 | VCO2.8 20.64,51.24 | 19.69,48.74 20.64,48.74 | 19.69,43.66 VCO2.5 | 19.69,43.66 20.01,43.66 | VCO2.4 17.78,40.01 | VCO2.3 15.24,40.01 | VCO2.1 10.16,40.01 | 7.47,43.66 6.51,43.66 | 7.5,46.2 7.47,46.2 | VCO2.13 6.51,51.24 | 10.48,53.15 9.21,53.15 | 9.21,53.15 9.21,52.07 v8.89,51.75 | 9.21,53.15 9.21,54.13 | 30.99,52.7 VCO1.13 | VCO1.12 32.77,52.07 32.71,52.07 | 40.39,53.18 40.39,54.45 40.17,54.45 40.17,56.04 42.07,56.04 v42.07,60.33 40.64,60.33 40.64,63.66 42.07,63.66 42.07,64.93 | 43.18,51.28 44.14,51.28 | VCO1.8 43.18,51.28 | 43.18,48.74 44.14,48.74 | 43.18,46.2 44.14,46.2 | VCO1.6 43.18,46.2 | 43.5,43.66 43.18,43.66 | VCO1.5 43.18,43.66 | VCO1.4 41.28,39.85 | VCO1.3 38.74,39.85 | 30.99,46.2 30.96,46.2 | 30.96,43.66 30.01,43.66 | 0.96,45.72 v3.18,45.72 | IC11.2 25.4,51.28 | 43.18,48.74 v43.18,47.47 43.18,46.2 | 20.01,43.66 20.64,43.66 | 7.47,46.2 6.51,46.2 | 43.5,43.66 44.14,43.66 | 30.96,46.2 30.01,46.2 | v51.76,71.75 v51.76,69.22 v51.76,66.67 v51.76,64.14 v51.76,61.59 v51.76,59.05 v51.76,56.52 v51.76,53.98 v51.76,51.44 v51.76,48.9 v51.76,46.35 v51.76,43.81 v51.76,41.27 v51.76,38.73 v49.85,38.73 v47.63,38.73 v45.09,38.73 42.87,40.96 v42.39,40.96
  Top 0.2: 0.96,45.72 v0.96,46.35 v0.96,48.9 v0.96,51.44 v0.96,53.98 v0.96,56.52 v0.96,59.05 | v0.96,59.05 v0.96,61.59 v0.96,64.14 v0.96,66.67 v0.96,69.22 | v0.96,69.22 v0.96,71.75 | v12.86,64.93 v12.86,63.82 v12.86,62.55 v12.86,61.28 v12.86,60.01 v11.75,60.01 10.96,60.01 v10.96,59.05 v8.89,59.05 v6.35,59.05 v3.66,59.05 v0.96,59.05 | 35.41,53.15 35.41,54.29 | VCO1.11 35.41,53.15 | VCO1.11 33.98,53.15 | C14.2 16.99,15.56 18.25,14.3 v18.25,13.9 | v45.88,7.46 43.26,4.83 R12.1 | 30.96,51.28 v27.63,51.28 IC11.2 | 42.07,64.93 v40.8,64.93 C37.2 | C37.2 39.71,65.56 39.69,65.56 39.69,64.93 | C37.2 39.69,64.93 | 39.69,64.93 39.06,64.93 | 40.39,53.18 39.37,53.18 | 35.41,53.15 36.36,53.15 | 35.31,72.35 C43.2 | C43.2 C44.2 | C44.2 31.6,73.89 | 31.6,73.89 C45.2 | C42.1 20.48,73.89 C41.1 | C41.1 C40.1 | C40.1 16.9,72.35 | C43.2 33.34,73.03 | C43.2 33.34,71.6 | C44.2 30.96,72.35 | C44.2 31.6,71.75 | C45.2 29.53,74.61 | C45.2 29.53,73.18 | C42.1 22.55,74.61 | C42.1 22.55,73.18 | C41.1 21.12,72.35 | C41.1 20.48,71.75 | C40.1 18.74,73.03 | C40.1 18.74,71.75 | 40.39,73.66 40.39,73.5 v39.37,73.5 v39.37,72.23 v39.37,70.96 v39.37,69.85 v39.37,68.74 v39.37,67.79 v39.37,66.83 v39.37,66.04 v40.64,66.04 42.07,66.04 42.07,64.93 | 31.6,73.89 31.6,74.3 v33.18,74.3 | v38.26,67.79 v37.15,67.79 v35.88,67.79 v34.29,67.79 v32.87,67.79 32.55,67.47 C55.1 | C45.2 26.67,73.89 | 26.67,73.89 C42.1 | 11.75,53.02 VCO2.11 | VCO2.11 11.82,54.45 v12.86,54.45 v12.86,55.56 v12.86,56.52 12.49,56.52 R26.2 | v9.21,67.79 v10.96,67.79 T3.4 v12.39,67.79 v13.66,67.79 T3.2 | v15.88,66.04 16.21,66.04 C39.2 | v15.88,63.82 16.21,63.82 | C39.2 16.83,64.93 | v0.96,69.22 v3.66,69.22 v6.35,69.22 v9.53,69.22 9.53,71.75 v10.96,71.75 11.82,71.75 11.82,73.66
  Top 0.2: 16.9,53.18 15.88,53.18 | 26.67,73.89 26.67,67.79 v26.04,67.79 v22.5,67.3 18.1,67.79 | 11.75,53.15 10.48,53.15 | VCO1.13 30.96,51.28 | C39.2 15.56,64.93 | 11.75,53.02 11.75,53.15 | 32.87,36.35 33.18,36.67 35.41,36.67 35.72,36.35 C22.2 | C8.2 42.62,31.52 JP2.6 | C55.1 C48.1 | C55.1 C58.1 | C57.1 C52.1 | C51.1 21.59,61.97 IC13.2 24.29,61.97 24.29,62.07 | C56.1 C51.1 | C56.1 19.17,62.12 18.1,63.18 | VCO1.12 32.77,57.24 31.44,58.58 | 18.1,67.79 v15.88,67.79 | C58.1 30.53,64.41 | C58.1 31.28,65.09 | C58.1 31.28,63.66 | C55.1 32.55,63.82 | C48.1 33.82,65.09 | C48.1 33.82,63.82 | 31.44,58.58 31.44,57.41 IC13.12 28.26,57.41 | 31.44,58.58 31.44,58.72 IC13.14 28.1,58.72 | C51.1 21.44,62.87 | C51.1 21.44,61.59 | C56.1 20.17,61.59 | C56.1 20.17,62.71 | VCO2.4 v19.53,40.96 19.69,41.12 VCO2.5 | 16.9,53.18 16.9,54.23 16.83,54.29 | R44.2 18.85,55.88 | R44.2 18.1,55.09 | R44.2 19.53,55.09 | 16.21,63.82 C39.2 | 16.21,63.82 16.21,63.77 | 18.1,67.79 18.1,63.18 | R26.2 12.49,59.53 12.55,59.53 | R26.2 13.18,58.74 | R26.2 11.75,58.74 | 20.37,53.23 C57.1 | 20.32,53.18 20.37,53.23 | 20.32,53.18 20.37,53.18 20.37,53.23 | 18.85,53.23 R44.2 | 16.9,53.18 18.85,53.18 | 18.9,53.18 18.85,53.23 | 18.85,53.18 18.9,53.18 | C52.1 19.69,55.88 | C52.1 20.37,56.58 | C52.1 21.12,55.88 | C57.1 19.69,54.45 | C57.1 21.12,54.45 | 18.1,63.18 17.31,63.18 17.31,60.12 | 17.31,60.12 15.88,60.12 v15.88,59.85 | 17.31,60.12 17.31,59.37 | 17.31,60.12 18.1,60.12 | VCO2.11 11.75,53.15 | 39.69,64.93 39.69,58.76 | 39.69,58.76 R22.2 | R22.2 39.71,58.12 | R22.2 40.33,58.74 | 39.69,58.76 39.67,58.74 | R22.2 39.67,58.74 | 39.67,58.74 39.06,58.74 | R41.2 30.99,55.09 30.99,52.7 | R41.2 34.14,55.09 | R41.2 33.54,54.45 | R41.2 33.54,55.72
  Top 0.2: C48.1 35.04,64.41 R31.2 | R31.2 35.04,61.12 | R31.2 35.72,61.87 | R31.2 34.29,61.87 34.29,61.75 | 19.69,53.18 20.32,53.18 | 18.85,53.18 18.85,53.23 | 18.9,53.18 19.69,53.18 | VCO2.11 12.99,53.15 | v42.39,40.96 VCO1.4 | 2.7,21.72 C18.2 | v29.37,18.26 30.48,17.14 30.48,13.97 30.01,13.49 v28.9,13.49 | T5.2 24.35,11.32 24.77,11.75 v28.1,11.75 29.94,11.75 R48.2 | v42.39,40.96 43.18,41.75 VCO1.5 | 13.18,23.18 IC3.5
  Top 0.5: IC4.1 IC4.8 36.2,29.37 37.15,28.42 37.15,26.19 36.68,25.72 36.68,20 34.14,17.46 R2.2 34.14,15.88 32.71,14.45 32.71,10.64 v32.39,10.32 v32.39,6.51 | C16.2 15.09,17.62 14.54,18.17 C5.2 11.52,18.17 11.12,18.57 R6.2 C17.2 | 37.4,5.57 C4.2 | C16.2 16.13,20.07 15.56,20.64 | 15.56,20.64 15.88,20.95 15.88,22.86 15.56,23.18 13.18,23.18 12.39,23.97 12.39,25.4 11.54,26.25 10.55,26.25 9.53,27.27 v9.53,27.78 9.53,29.84 v13.5,33.81 C20.2 16.72,25.2 18.74,23.18 IC3.4 | C18.2 5.28,19.77 C15.2 C17.2 | C16.2 C14.2 16.36,15.33 16.36,13.55 C1.2 | 15.56,20.64 IC3.7 | C17.2 C11.2 | C6.2 6.99,9.21 7.78,10 9.85,10 | C2.2 12.86,6.35 12.55,6.67 C10.2 12.55,9.21 11.75,10 9.85,10 | 9.85,10 IC1.2 | 35.31,72.35 JP5.1 33.5,76.3 | 16.9,72.35 JP6.3 18.9,76.3 | 42.23,76.3 JP5.3 40.39,73.66 | 11.82,73.66 JP6.1 10.01,76.3 | v49.53,24.77 49.49,24.77 | JP1.4 2.7,21.72 | T5.2
  Top 0.8: v21.28,2.38 11.12,2.38 6.99,6.51 C6.2 5.63,8.34 4.45,9.53 4.45,15.72 JP1.4 0.96,19.21 v0.96,35.88 v0.96,38.73 | 44.3,19.21 44.77,19.68 44.77,22.86 44.14,23.5 39.53,23.5 38.9,24.13 R4.2 | C8.2 C7.2 45.09,26.83 | 44.3,19.21 IC2.2 42.55,19.21 42.07,18.73 v42.07,17.78 42.07,7.3 40.34,5.57 37.4,5.57 C3.2 v36.36,5.56 | 49.49,24.77 C13.2 45.77,26.15 45.09,26.83 | v50.17,16.35 47.15,16.35 44.3,19.21 | 45.09,26.83 v45.09,38.73
  Top 0.965: v39.37,67.79 v38.26,67.79 | v15.88,67.79 v14.77,67.79
  Bottom 0.2: v13.5,33.81 R39.2 | IC8.6 29.21,11.27 28.74,10.79 28.74,8.41 29.69,7.46 v45.88,7.46 46.96,7.46 48.97,9.47 R19.2 R11.1 C23.1 C24.2 R10.2 48.97,24.22 | 47.63,25.56 48.97,24.22 | 47.63,25.56 43.03,25.56 41.83,24.36 R18.2 41.6,21.2 IC9.4 41.6,18.26 v42.07,17.78 | C31.2 29.14,19.12 29.37,18.89 | IC8.6 32.79,11.27 C28.2 33.02,10.95 v32.39,10.32 | IC8.6 IC8.5 29.21,12.54 28.9,12.86 v28.9,13.49 28.1,12.7 v28.1,11.75 | IC6.14 18.1,23.18 16.83,21.91 | IC6.1 IC6.2 16.83,21.91 | 16.83,21.91 16.36,22.38 13.5,22.38 13.02,21.91 IC6.5 13.02,18.26 12.07,17.3 v12.07,16.67 C26.2 | 32.87,31.91 32.87,31.27 32.49,30.89 IC5.21 32.49,23.03 C21.2 32.16,18.34 31.75,17.94 29.69,17.94 v29.37,18.26 | IC5.5 33.25,32.29 32.87,31.91 | 32.87,31.91 32.07,31.91 31.7,32.28 IC5.3 | v16.83,43.66 16.83,42.86 v16.83,42.23 16.83,41.27 v16.51,40.96 16.51,39.37 v15.88,38.73 v13.82,38.73 v11.61,38.73 v10.16,38.73 v8.58,38.73 8.58,39.05 8.06,39.56 D5.1 | C33.2 C35.2 | C35.2 0.96,53.5 v0.96,53.98 | C33.2 0.96,51.12 v0.96,51.44 | C35.2 2.16,54.61 | C35.2 2.86,53.5 | C33.2 2.86,51.12 | C33.2 2.16,50.01 | v3.18,45.72 3.18,43.5 | v9.53,27.78 9.53,28.96 C25.2 | C60.1 C59.1 | C59.1 22.39,48.74 22.32,48.66 C64.2 | C60.1 26.88,51.28 v27.63,51.28 | C60.1 26.2,50.16 | C60.1 27.47,50.16 | C59.1 27.47,48.74 | C59.1 26.88,48.1 | C64.2 23.02,47.15 | C64.2 22.32,43.38 C63.1 | C63.1 23.34,44.13 | C63.1 23.34,43.34 | 23.34,43.34 24.13,43.34 24.13,43.81 25.88,43.81 IC14.2 25.88,41.75 | 23.34,43.34 23.34,42.7 | v9.21,67.79 v10.96,67.79 v12.39,67.79 v13.66,67.79 v14.77,67.79 v15.88,67.79 v15.88,66.83 v15.88,66.04 v15.88,63.82 v15.88,62.87 v15.88,61.91 v15.88,60.96 v15.88,59.85 v15.88,58.74 v15.88,57.63 v15.88,56.52 15.88,51.91 v15.56,51.59
  Bottom 0.2: 48.97,24.22 49.52,24.77 v49.53,24.77 | 23.02,55.56 22.5,56.08 C53.2 | X1.4 29.84,57.58 C54.1 | 23.02,55.56 23.02,54.29 22.91,53.18 | v26.04,67.79 26.52,67.31 | C54.1 31.44,56.83 | C54.1 32.07,57.58 32.07,57.47 | 29.37,58.1 29.37,57.15 | X1.4 29.37,58.1 | X1.4 27.79,58.1 | 29.37,58.1 29.37,59.05 | 23.02,55.56 23.02,56.67 | C53.2 20.96,56.83 | 20.96,55.4 C53.2 | v23.98,23.65 22.95,23.65 R38.2 C61.2 | R46.2 48.35,26.28 47.63,25.56 | R14.2 C27.2 18.1,9.28 IC7.1 18.1,13.75 v18.25,13.9 | v24.61,13.49 IC8.4 | v47.63,38.73 48.3,39.41 D6.1 | D6.1 48.3,42.83 | D6.1 v50.01,41.27 | D6.1 v46.68,41.27 | D5.1 6.92,41.27 | D5.1 8.06,42.98 | D5.1 9.53,41.27 | v0.96,35.88 0.99,35.91 S2.2
  Bottom 0.5: 18.42,42.86 18.42,44.45 | 16.83,42.86 18.42,42.86 | 18.42,42.86 18.42,41.43 | 18.42,42.86 19.69,42.86 | JP5.3 42.39,76.3 | JP5.3 JP5.1 | JP5.1 35.31,73.66 | JP5.1 33.34,76.3 | JP5.3 40.39,73.66 | 26.52,67.31 IC12.6 26.52,64.93 | JP6.1 JP6.3 | JP6.3 18.74,76.3 | JP6.1 9.85,76.3 | JP6.1 11.82,73.66 | JP6.3 16.9,73.66 | v29.37,18.26 29.37,18.89
  Bottom 0.8: v49.53,24.77 50.17,24.13 v50.17,16.35 | v21.28,2.38 23.82,2.38 27.94,6.51 v32.39,6.51 35.41,6.51 v36.36,5.56
  other vias: 16.83,47.47 15.88,49.21 14.29,47.47 46.68,56.52 49.22,56.52 44.14,56.52 39.06,48.74 37.79,50.01 35.25,48.74 45.09,50.16 6.83,76.83 26.04,76.83 35.25,43.66 36.2,42.23 39.06,43.66 40.8,45.24 49.22,43.81 49.22,46.35 46.68,46.35 46.68,43.81 45.09,45.09 45.09,47.62 39.06,46.2 37.31,44.77 37.31,47.47 40.8,47.47 35.25,46.35 37.31,38.73 40.01,38.73 42.55,38.73 28.1,41.12 29.06,40.01 33.98,39.53 45.09,43.18 27.94,46.04 27.94,43.81 46.68,48.9 49.22,48.9 49.22,51.44 41.91,46.2 46.68,53.98 49.22,53.98 46.68,51.44 45.09,52.7 44.14,53.98 42.07,55.24 44.14,59.05 46.68,59.05 49.22,59.05 49.22,66.67 46.68,66.67 44.14,66.67 44.14,69.22 46.68,69.22 49.22,69.22 49.22,64.14 49.22,61.59 46.68,61.59 44.14,64.14 44.14,61.59 46.68,64.14 42.07,62.87 42.07,67.94 40.8,69.22 42.07,70.48 40.64,63.82 27.47,59.37 26.36,61.16 26.36,62.87 33.18,66.36 34.93,66.04 36.36,62.55 36.36,63.82 36.36,64.93 36.36,66.04 36.36,61.28 36.36,60.01 36.36,58.9 36.36,57.78 36.36,56.67 39.37,55.72 39.37,56.67 40.49,57.78 39.37,57.78 40.8,58.74 40.49,59.85 39.37,59.85 17.47,66.83 17.47,69.22 19.37,69.22 21.12,69.22 19.37,66.83 19.37,64.93 17.47,64.93 18.42,63.82 26.04,70.17 24.13,69.22 15.88,68.74 15.88,69.75 10.96,69.53 9.53,66.36 10.96,66.04 12.86,66.04 10.96,64.14 8.89,64.14 6.35,64.14 6.35,66.67 15.88,73.5 15.88,72.65 15.88,71.86 17.47,71.75 18.9,75.56 18.9,76.83 21.44,76.83 18.9,74.3 18.26,73.5 9.69,76.83 9.69,75.56 9.69,74.3 10.48,73.5 12.86,73.5 12.86,72.55 12.86,71.6 12.86,70.64 8.89,71.75 7.15,74.3 6.35,71.75 39.37,54.61 33.66,60.64 39.37,63.82 39.37,62.55 34.93,63.82 39.37,61.28 18.42,62.07 18.42,60.96 10.96,61.59 8.89,61.59 6.35,61.59 3.66,61.59 3.66,64.14 3.66,66.67 3.66,71.6 12.86,69.53 8.89,54.61 10.54,53.18 10.96,56.52 12.86,57.63 11.75,57.63 8.89,56.52 3.66,56.52 6.35,56.52 6.35,53.5 3.66,51.12 13.02,49.21 14.45,50.32 3.66,53.5 13.02,46.2 11.75,47.47 15.88,45.88 23.98,41.22 22.39,41.91 22.39,49.69 23.98,47.15 23.98,49.69 28.41,53.24 18.42,51.28 23.98,76.83 28.1,76.83 30.64,76.83 33.18,76.83 33.18,75.56 36.36,73.5 34.14,73.5 42.39,74.3 42.39,76.83 44.14,76.83 45.88,76.83 45.57,74.3 44.14,74.3 44.14,71.75 42.07,72.87 40.8,71.6 36.36,69.53 34.93,69.53 31.44,68.74 33.18,69.22 36.36,71.91 28.1,74.3 30.96,74.3 26.04,74.3 23.98,74.3 21.12,74.3 27.94,69.22 49.22,71.6 46.68,71.75 42.39,75.56 3.5,43.02 5.08,42.39 5.08,40.64 2.54,40.64 5.72,46.2 7.15,38.73 18.38,46.18 17.78,38.73 19.53,38.73
  pour Top: 0.05,79 53.05,79 53.05,38 0.05,38
  pour Bottom: 0.05,79 53.05,79 53.05,38 0.05,38
IN  (via drill 0.33)
  Top 0.2: JP3.2 v3.81,40.64
  Bottom 0.2: IC10.3 2.23,43.02 3.81,41.43 v3.81,40.64
  Bottom 0.406: IC10.3
LE  (via drill 0.33 pad 0.25)
  Top 0.2: IC13.18 29.14,61.28 30.32,61.28 v30.62,61.58
  Bottom 0.2: IC5.12 38.17,29.27 38.74,29.84 38.74,34.61 34.61,38.73 33.66,38.73 30.17,42.23 30.17,45.24 30.64,45.72 30.64,52.23 33.5,55.09 33.5,59.21 31.44,61.28 31.14,61.58 v30.62,61.58
  Bottom 0.5: IC5.12
LOWBATT  (via drill 0.33)
  Top 0.2: R1.2 R2.1 34.14,14.61 35.41,15.88 35.41,17.46 37.47,19.53 37.47,23.18 v37.79,23.5
  Bottom 0.2: IC5.19 34.03,21.69 34.29,21.43 35.72,21.43 v37.79,23.5
  Bottom 0.5: IC5.19
MISO
  Bottom 0.2: IC5.16 46.95,26.15 47.79,26.99 47.79,30.8 | 47.79,30.8 43.18,35.4 41.28,35.4 JP2.1 | 47.79,30.8 48.58,31.59 48.58,35.56 48.94,35.91 S1.1
  Bottom 0.5: IC5.16
MOSI
  Bottom 0.2: IC5.15 42.6,26.94 42.87,26.67 46.84,26.67 47.31,27.15 47.31,29.37 JP2.4
  Bottom 0.5: IC5.15
N$1  (via drill 3)
  other vias: 3.66,4.6
N$2  (via drill 3)
  other vias: 49.06,4.6
N$49  (via drill 0.33)
  other vias: 3.66,48.74
N$137  (via drill 0.33)
  other vias: 29.53,72.39
N$138  (via drill 0.33)
  other vias: 22.55,72.39
N$172  (via drill 3)
  other vias: 3.66,75.09
N$173  (via drill 3)
  other vias: 49.06,75.09
N$178  (via drill 0.33)
  other vias: 29.85,54.13
N$180  (via drill 0.33)
  other vias: 29.53,67.63
OSCIN  (via drill 0.33)
  Top 0.2: IC13.8 21.47,58.06 v20.96,58.58
  Bottom 0.2: X1.1 22.5,57.58 C53.1 v20.96,58.58
OUT
  Bottom 0.2: IC6.13 16.83,27.62 17.31,28.1 18.42,28.1 19.05,27.46 19.05,19.84 | 19.05,19.84 18.42,19.21 16.04,19.21 15.56,19.68 IC6.3 | 19.05,19.84 19.69,19.21 24.13,19.21 24.45,18.89 24.45,15.24 26.05,13.64 26.05,11 25.05,10 IC8.2 IC8.1
OUTA  (via drill 0.33)
  Top 0.2: 22.46,66.04 R29.2
  Top 0.5: v21.28,66.04 22.46,66.04
  Bottom 0.5: v21.28,66.04 IC12.8
OUTB  (via drill 0.33)
  Top 0.2: 29.62,66.04 R28.2
  Top 0.5: v30.8,66.04 29.62,66.04
  Bottom 0.5: IC12.5 v30.8,66.04
PCI12/ADC4/SDA/PC4
  Bottom 0.2: IC5.27 27.05,27.72 22.23,32.54 10.16,32.54 7.94,30.32 7.94,23.18 8.74,22.38 R15.1
PCI13/ADC5/SCL/PC5  (via drill 0.33)
  Top 0.2: v19.53,33.81 19.53,35.08 19.92,35.47 C62.1 19.92,37.7 21.12,38.89 21.12,51.28 24.65,54.81 R37.2 24.65,56.24 26.67,58.26 26.67,59.53 26.19,60.02 25.71,60.5 24.75,60.5 24.27,60.02 IC13.5
  Bottom 0.2: IC5.28 27.06,28.51 21.75,33.81 v19.53,33.81 R39.1
PCI23/AIN1/PD7  (via drill 0.33)
  Top 0.2: D4.1 34,2.54 29.21,2.54 28.26,3.49 28.26,4.13 31.6,7.46 31.6,10.79 32.07,11.27 32.07,16.51 35.88,20.32 v35.88,27.66
  Bottom 0.2: v35.88,27.66 35.88,29.53 36.42,30.06 37.05,30.06 IC5.11
  Bottom 0.5: IC5.11 37.05,30.06
PIN3
  Top 0.2: L6.1 37.85,70.8 | T2.3 C47.1 38.01,71.96 38.05,72 38.05,71.37 L6.1 | L6.1 37.47,70.8
RESET  (via drill 0.33)
  Top 0.2: C22.1 R7.2 38.97,32.63 JP2.5 | v43.82,30.48 43.82,37.15 43.18,37.78 28.26,37.78 26.98,36.5 24.4,36.5 23.21,35.31 v23.21,34.98
  Bottom 0.2: IC5.29 27.25,29.27 25.88,30.64 25.88,32.54 23.45,34.98 v23.21,34.98 | v43.82,30.48 41.12,30.48 JP2.5
SCK  (via drill 0.33)
  Top 0.2: v35.5,31.43 36.99,31.43 38.1,30.32 40.49,30.32 41.28,31.11 41.28,32.86 JP2.3
  Bottom 0.2: IC5.17 35.61,25 35.61,26.63 35.25,26.99 34.85,27.39 34.85,27.65 35.25,28.05 35.25,31.19 v35.5,31.43
  Bottom 0.5: IC5.17 35.61,25
SDI
  Bottom 0.2: IC5.25 26.56,26.15 21.44,31.27 11.91,31.27 10.8,30.16 10.8,27.78 10.48,27.46 IC6.8
SIG$8
  Top 0.5: R6.1 11.35,23 | IC3.8 13.18,19.37 12.55,20 12.55,22.38 12.16,22.77 R6.1 | R5.2 10.87,23.02 R6.1
SIG$18
  Bottom 0.2: IC5.13 42.65,28.51 42.87,28.73 45.72,28.73 46.04,28.42 R8.1
  Bottom 0.5: IC5.13
SIG$19
  Bottom 0.2: R9.1 37.19,27.69 IC5.14
  Bottom 0.5: IC5.14
SIG$20
  Top 0.2: D4.2 R12.2
SIG$22
  Bottom 0.2: IC5.30 27.41,30.06 26.36,31.11 26.36,33.18 23.82,35.72 5.88,35.72 4.45,34.29 4.45,14.13 JP1.2
  Bottom 0.5: IC5.30
SIG$30
  Bottom 0.2: R13.2 19.69,5.71 18.9,4.92 15.72,4.92 15.33,5.31 R14.1 13.02,6.35 12.38,6.99 T1.1
SIG$31
  Bottom 0.2: T1.2 10.48,11.9 8.74,13.65 R15.2
SIG$34
  Bottom 0.2: C30.1 19.21,17.94 18.74,18.41 15.56,18.41 14.29,19.68 IC6.4
SIG$35
  Bottom 0.2: IC6.12 15.56,28.73 16.83,30 20.17,30 21.59,28.57 21.59,20.95 22.07,20.48 30.8,20.48 31.05,20.23 C29.1
SIG$37
  Bottom 0.2: C29.2 34.05,20.23 34.61,20.8 35.72,20.8 37.63,22.7 39.69,22.7 40.33,22.07 IC9.3 40.33,18.1 41.44,16.99 42.87,16.99 43.5,17.62 R17.1
SIG$39
  Bottom 0.2: 36.13,14.92 39.85,14.92 40.33,14.45 IC9.6 40.05,13.22 40.05,13 40.83,12.22 44.77,12.22 45.41,12.86 R19.1
  Bottom 0.406: R20.2 36.13,14.84 36.13,14.92
SIG$40
  Bottom 0.2: IC9.2 39.06,21.2 R18.1 36.99,21.43 36.2,20.64 R21.2
SIG$41  (via drill 0.33)
  Top 0.2: VCO2.2 v12.7,39.69 12.7,38.26 13.02,37.94 17.63,37.94 18.58,36.99 18.58,32.63 17.63,31.68 v17.63,28.89
  Bottom 0.2: IC9.1 37.79,17.46 37.24,16.91 R21.1 31.03,16.91 30.48,17.46 28.74,17.46 26.36,19.84 21.44,19.84 20.32,20.95 20.32,27.94 19.37,28.89 v17.63,28.89 | v12.7,39.69 12.7,40.84 D5.2
SIG$42  (via drill 0.33)
  Top 0.2: v47.63,10.32 49.69,10.32 51.76,12.38 51.76,27.94 v47.63,32.07 | v36.2,39.69 VCO1.2
  Bottom 0.2: v47.63,32.07 44.14,35.56 44.14,41.12 | v36.2,39.69 42.71,39.69 44.1,41.08 | 44.14,41.12 44.14,41.24 D6.2 44.1,41.08 | 44.14,41.12 44.1,41.08 | v47.63,10.32 47.6,10.35 41.4,10.35 39.06,12.7 IC9.7 39.06,12.65 38.2,11.8 36.08,11.8 R20.1
SIG$44
  Top 0.2: 29.13,48.7 L5.1 C32.1
  Top 0.3: 29.13,48.7 VCO1.14 | C34.1 C32.1
  Top 0.406: VCO1.14
SIG$45
  Top 0.2: IC11.4 28.1,50.32 27.63,49.85 27.63,48.9 26.99,48.26 L5.2
SIG$46
  Bottom 0.2: IC10.4 2.23,48.74 L4.2
  Bottom 0.406: IC10.4
SIG$48
  Top 0.2: IC11.3 25.41,50.33 24.77,49.69 24.77,42.7 26.04,41.43 JP4.2
SIG$51
  Top 0.2: T3.1 14.71,65.93 C39.1 14.36,64.93 C38.2
SIG$52  (1 unrouted)
  Top 0.2: 38.15,64.93 37.85,64.93 | T2.1 38.21,65.92 C37.1 37.85,64.57 C36.2
SIG$55
  Top 0.2: C46.1 14.71,71.61 L7.1 14.36,70.8 T3.3
SIG$56
  Top 0.2: L7.2 16.21,70.85 | C41.2 20.48,70.89
  Top 0.5: 16.21,70.85 C40.2 C41.2 | 20.48,70.89 C42.2 R29.1
SIG$57  (1 unrouted)
  Top 0.2: C43.1 33.34,70.8 | 29.53,70.85 C45.1
  Top 0.5: 33.34,70.8 35.97,70.8 | C43.1 C44.1 29.53,70.85 R28.1
SIG$62  (via drill 0.33)
  Top 0.2: IC13.19 27.99,61.97 v27.64,61.61
  Bottom 0.2: IC5.9 37.16,34.28 33.98,37.47 33.34,37.47 29.21,41.59 29.21,45.56 29.69,46.04 29.69,52.7 32.55,55.56 32.55,58.42 31.44,59.53 28.58,59.53 27.79,60.33 27.64,60.48 v27.64,61.61
  Bottom 0.5: IC5.9
SIG$65
  Top 0.2: IC13.3 21.95,61.31 21.28,60.64 19.53,60.64 18.9,60.01 C49.2
SIG$66
  Top 0.2: C50.2 29.1,59.37 IC13.15
SIG$69
  Top 0.2: IC13.1 23.3,63.23 22.91,63.62 C51.2 C56.2 20.17,64.29 20.48,64.61 R32.2
SIG$70
  Top 0.2: C57.2 C52.2 R33.2 21.97,57.41 IC13.9
SIG$71
  Top 0.2: R34.2 29.17,64.02 30.28,62.91 C58.2 C55.2 32.55,62.07 31.14,60.66 IC13.17
SIG$72  (via drill 0.33)
  Top 0.2: 22.07,59.69 22.4,59.37 IC13.6 v24.76,59.37 v24.77,59.37 | 22.07,59.69 22.07,60.33 22.41,60.66 IC13.4 24.16,60.66 24.88,61.39 R32.1 R34.1 | R37.1 26.15,54.36 R36.1 25.25,54.29 v24.77,53.82 | 22.07,59.69 20.48,59.69 20.01,59.21 20.01,58.26 20.37,57.9 R33.1
  Bottom 0.2: R35.1 C59.2 C60.2 28.38,51.64 26.2,53.82 v24.77,53.82 v24.77,59.37
SIG$73
  Bottom 0.2: IC14.4 23.34,44.97 C63.2
SIG$76
  Top 0.2: C47.2 37.85,74.8 38.05,75 38.05,76.09 JP5.2
SIG$77
  Top 0.2: C46.2 JP6.2
SIG$78  (via drill 0.33)
  Top 0.2: v25.72,58.49 24.52,58.49 24.25,58.75 23.33,58.75 IC13.7
  Bottom 0.2: C54.2 29.84,56.08 X1.3 27.79,55.56 25.72,57.63 v25.72,58.49
SIG$79
  Top 0.5: C2.1 10.73,4.67 12.07,3.33 17.47,3.33 18.1,3.97 JP7.2 | C2.1 10.73,8.66 IC1.3 | C2.1 9.69,6.35 8.89,7.14 IC1.1
SIG$80
  Top 0.2: R23.2 37.85,59 | 37.85,59 R24.1 | R22.1 38.05,58.9 38.05,59 37.85,59
SIG$81
  Top 0.2: R27.2 13.99,59.37 R26.1 14.36,58.37 R25.1
SIG$82
  Top 0.2: C36.1 R24.2
SIG$83  (1 unrouted)
  Top 0.2: 17.35,56.04 17.31,56.08
  Top 0.8: R43.1 R44.1 17.35,56.04
SIG$84
  Top 0.2: 18.81,57.58 C49.1 18.9,57.58
  Top 0.5: R45.1 18.81,57.58 18.9,57.58
  Top 0.8: R45.1 R30.1
SIG$85
  Top 0.2: R42.2
  Top 0.8: R40.1 R41.1 R42.2
SIG$86
  Top 0.2: C50.1 | R31.1
  Top 0.8: R42.1 C50.1 | C50.1 R31.1
SIG$87
  Top 0.2: C38.1 R27.1
SIG$88
  Bottom 0.2: R46.1 49.85,31.65 S1.2
SIG$90  (via drill 0.33)  (1 unrouted)
  Top 0.2: 30.01,10 R48.1 | 30.01,10 29.53,10.48 T5.1 | 30.01,10 31.6,11.59 31.6,16.99 34.77,20.16 34.77,28.09 v34.45,28.41
  Bottom 0.2: v34.45,28.41 34.45,31.75 34.82,32.12 IC5.7
SW
  Top 0.5: D3.1 26.2,29.37 27.79,30.96 31.6,30.96 31.91,30.64 IC4.7 L3.2
SW1
  Top 0.2: L2.2
  Top 0.5: D2.1 L2.2 14.61,25.88 18.58,21.91 IC3.3
TRIG  (2 unrouted)
  Bottom 0.2: IC7.6 IC7.7 16.83,15.72 17.31,15.24 | C26.1 12.07,11.59 11.43,10.95 T1.3 12.97,9.89 13.66,9.21 13.66,8.57 14.45,7.78 16.2,7.78 16.83,8.41 IC7.2 16.83,14.76 17.31,15.24 | 17.31,15.24 21.12,15.24 23.05,13.31 23.05,12 23.78,11.27 IC8.3
VCC  (via drill 0.33)
  Top 0.2: v6.35,48.74 7.47,48.74 VCO2.14
  Top 0.406: VCO2.14
  Bottom 0.2: C35.1 C33.1 L4.1 v6.35,48.74
VCO1_DCADJ
  Bottom 0.2: R16.2 43.98,15.56 44.3,15.24 R11.2 C23.2 47.63,19.12 47.63,24.13 47.07,24.69 R8.2
VCO1_OUT
  Top 0.2: 37.79,53.15 VCO1.10 37.85,55.45 | 37.85,55.45 R40.2 | 37.85,55.45 R23.1
VCO2_DCADJ
  Bottom 0.2: R10.1 C24.1 43.82,20.32 43.5,20.64 R17.2 43.5,21.5 43.5,22.7 44.14,23.34 R9.2
VCO2_OUT
  Top 0.2: R25.2 14.36,55.44 R43.2 14.36,55.09 VCO2.10
VIN  (via drill 0.33 pad 0.25)
  Top 0.2: R1.1 34.14,5.8 C3.1
  Top 0.5: 39.37,15.56 L1.1 39.37,11.11 | 26.83,25.72 L3.1 | IC4.2 31.91,33.34 30.8,32.23 25.28,32.23 24.29,31.24 24.29,28.26 | IC3.2 18.74,20.64 18.1,20 18.1,17.94 18.42,17.62 C16.1 C14.1 19.13,13.42 22.07,10.48 22.07,7.62 21.59,7.14 | IC3.2 IC3.1 | IC3.2 21.12,20.64 21.44,20.95 21.44,23.97 19.69,25.72 L2.1 19.85,28.26 24.29,28.26 | C4.1 40.4,9.45 39.37,10.48 39.37,11.11 | 38.74,10.48 39.37,11.11 | JP7.1 C1.1 19.11,7.88 19.85,7.14 21.59,7.14 | T4.3 23,3.99 21.59,5.4 21.59,7.14 | 24.29,28.26 24.29,27.76 25.05,27 25.55,27 26.83,25.72 | IC4.6 30.64,28.59 30.05,28 29.12,28 26.83,25.72
  Top 0.7: IC2.4 IC2.5 40.8,16.99 39.37,15.56
  Top 0.8: 38.74,10.48 37.63,10.48 36.04,8.89 36.04,6.99 34.61,5.56 C3.1 33.61,5.56 33.05,5 30.4,5 30.23,4.82 | 30.23,4.82 v29.37,3.97 30.23,4.82 | v27.15,3.97 24.95,3.97 T4.3 | 30.23,4.82
  Bottom 0.8: v27.15,3.97 v29.37,3.97
VOUT
  Bottom 0.2: C64.1 R35.2 26.88,44.97 IC14.5
(copper drawn outside any net)
  shapes: Bottom area x4, Bottom circle x4, Top area x30, Top circle x2

## Text on the board
tPlace: 1 | 2 | 3 | 1 | 2 | 3 | TOP | 1 | 2 | 3
bPlace: BOTTOM